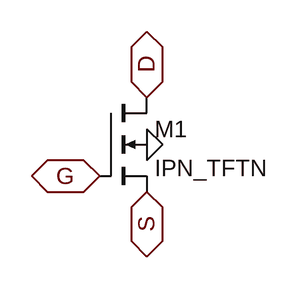
[diagram p0: schematic ipn_tftn.asc]
ipn_tftn.asc, the LTspice schematic file:
Version 4
SHEET 1 880 680
FLAG 208 176 0
FLAG 208 128 D
IOPIN 208 128 BiDir
FLAG 160 208 G
IOPIN 160 208 BiDir
FLAG 208 224 S
IOPIN 208 224 BiDir
SYMBOL nmos4 160 128 R0
SYMATTR InstName M1
SYMATTR Value IPN_TFTN
SYMATTR Value2 l={L} w={W}

The netlist it stands for:
* ipn_tftn.asc
M1 D G S 0 IPN_TFTN l={L} w={W}
.model NMOS NMOS
.model PMOS PMOS
.lib standard.mos
.backanno
.end